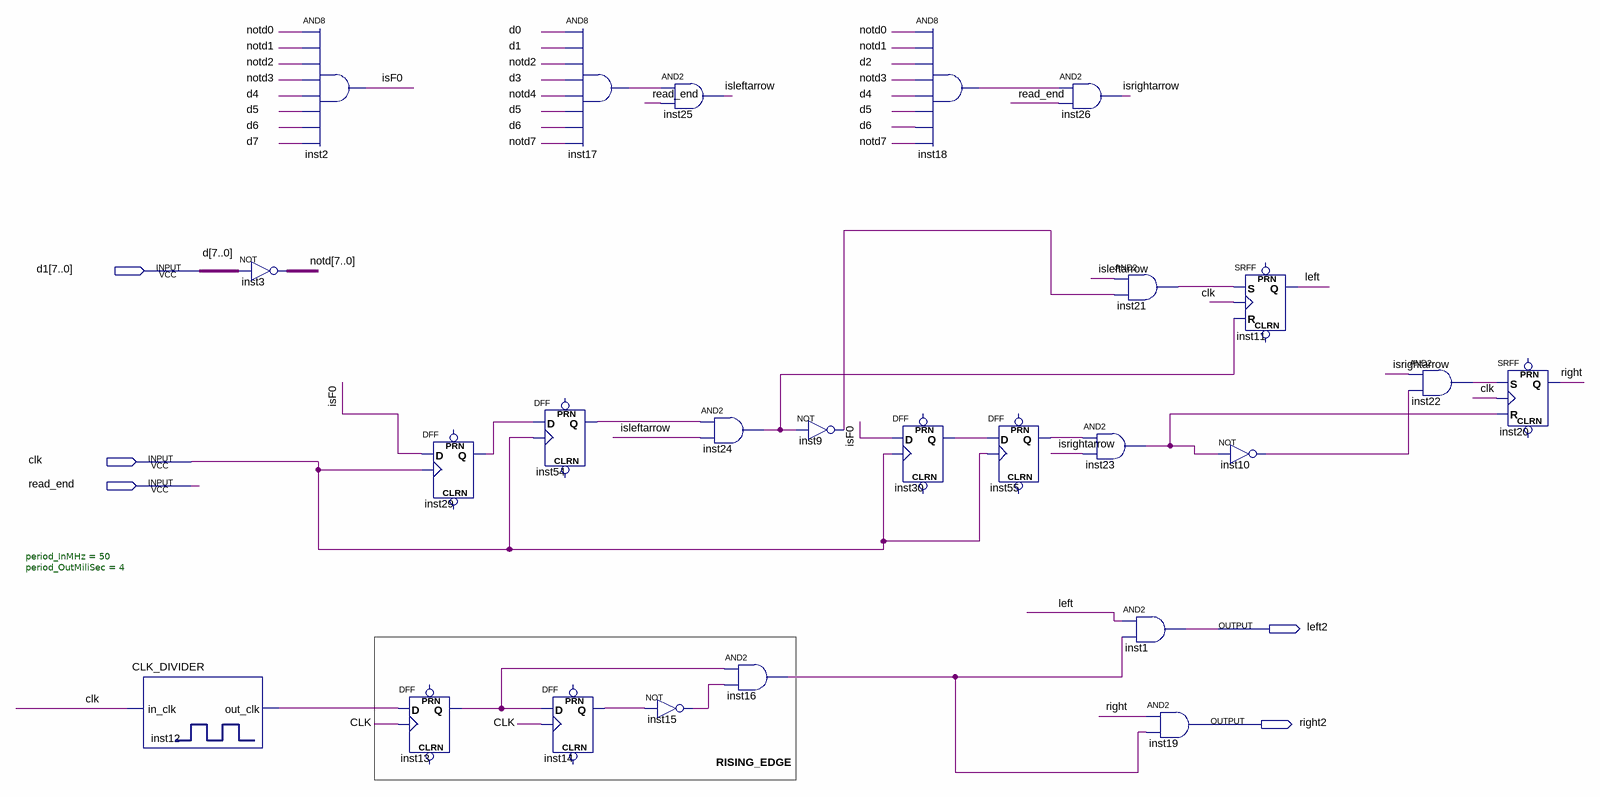
[diagram p0: schematic sheet]
// Quartus schematic KeyDetector2.bdf as structural Verilog: 25 symbols, 5 pins
module KeyDetector2 (
  input  [7:0] d1,
  input  clk,
  input  read_end,
  output left2,
  output right2
);

  wire inst9_out, inst10_out, inst12_out_clk, inst13_q, inst14_q, inst15_out, inst16_out, inst17_out,
       inst18_out, inst21_out, inst22_out, inst23_out, inst24_out, inst29_q, inst30_q, inst54_q, inst55_q,
       isF0, isleftarrow, isrightarrow, left, right;
  wire [7:0] notd;

  CLK_DIVIDER #(.period_InMHz(50), .period_OutMiliSec(4)) inst12 (.in_clk(clk), .out_clk(inst12_out_clk));
  assign notd = ~d1;  // NOT inst3, 8 bits wide
  and inst2 (isF0, notd[0], notd[1], notd[2], notd[3], d1[4], d1[5], d1[6], d1[7]);
  DFF inst29 (.CLK(clk), .D(isF0), .Q(inst29_q));  // open: CLRN, PRN
  DFF inst13 (.CLK(clk), .D(inst12_out_clk), .Q(inst13_q));  // open: CLRN, PRN
  DFF inst54 (.CLK(clk), .D(inst29_q), .Q(inst54_q));  // open: CLRN, PRN
  DFF inst14 (.CLK(clk), .D(inst13_q), .Q(inst14_q));  // open: CLRN, PRN
  and inst17 (inst17_out, d1[0], d1[1], notd[2], d1[3], notd[4], d1[5], d1[6], notd[7]);
  and inst25 (isleftarrow, inst17_out, read_end);
  not inst15 (inst15_out, inst14_q);
  and inst24 (inst24_out, inst54_q, isleftarrow);
  and inst16 (inst16_out, inst13_q, inst15_out);
  not inst9 (inst9_out, inst24_out);
  and inst18 (inst18_out, notd[0], notd[1], d1[2], notd[3], d1[4], d1[5], d1[6], notd[7]);
  DFF inst30 (.CLK(clk), .D(isF0), .Q(inst30_q));  // open: CLRN, PRN
  DFF inst55 (.CLK(clk), .D(inst30_q), .Q(inst55_q));  // open: CLRN, PRN
  and inst26 (isrightarrow, inst18_out, read_end);
  and inst21 (inst21_out, isleftarrow, inst9_out);
  and inst23 (inst23_out, inst55_q, isrightarrow);
  and inst1 (left2, left, inst16_out);
  and inst19 (right2, right, inst16_out);
  SRFF inst11 (.S(inst21_out), .R(inst24_out), .CLK(clk), .Q(left));  // open: PRN, CLRN
  not inst10 (inst10_out, inst23_out);
  and inst22 (inst22_out, isrightarrow, inst10_out);
  SRFF inst20 (.S(inst22_out), .R(inst23_out), .CLK(clk), .Q(right));  // open: PRN, CLRN

  // Other names for the same wires on the sheet: d[7:0] = d1; d0 = d1[0]; d1 = d1[1]; d2 = d1[2]; d3 = d1[3];
  //   d4 = d1[4]; d5 = d1[5]; d6 = d1[6]; d7 = d1[7]

  // Notes on the sheet:
  //   RISING_EDGE
endmodule
